# Altium schematic sheet Overview.SchDoc
size A4; SheetNumber: 1; SheetTotal: 7
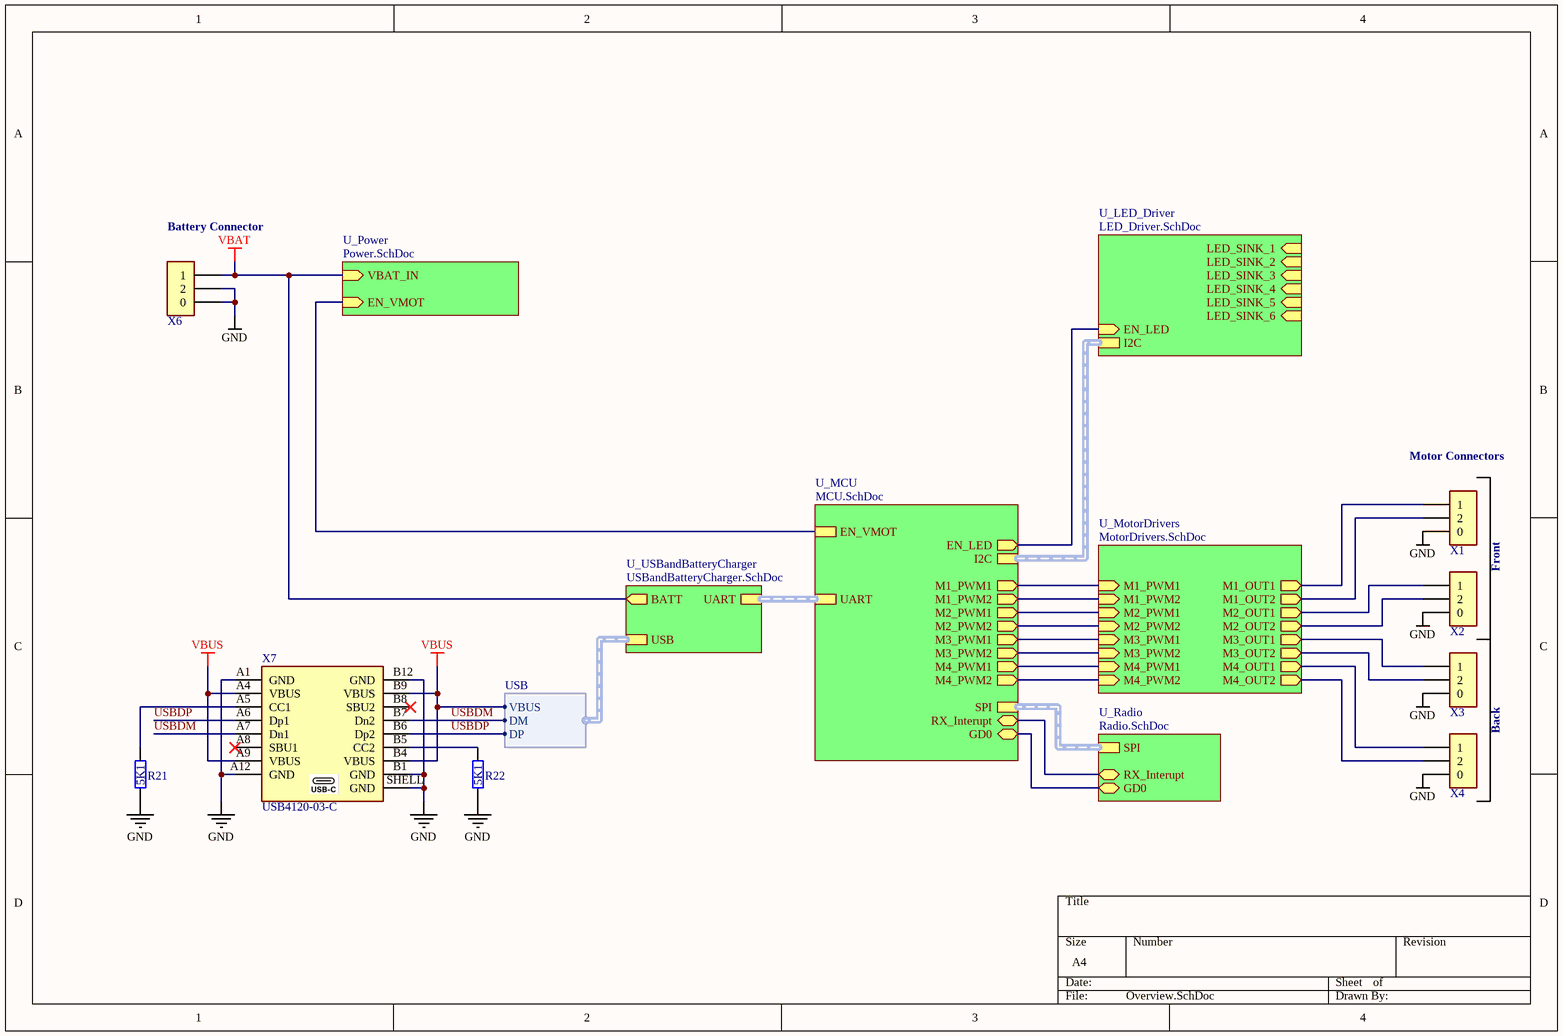
[diagram p0: Overview.SchDoc]

## Parts
R21  5K1  [0603]  (value not drawn)
R22  5K1  [0603]  (value not drawn)
X1  BM02B-SRSS-TB  [BM02B-SRSS-TB]  (value not drawn)
X2  BM02B-SRSS-TB  [BM02B-SRSS-TB]  (value not drawn)
X3  BM02B-SRSS-TB  [BM02B-SRSS-TB]  (value not drawn)
X4  BM02B-SRSS-TB  [BM02B-SRSS-TB]  (value not drawn)
X6  BM02B-SRSS-TB  [BM02B-SRSS-TB]  (value not drawn)
X7  USB4120-03-C  [USB4120]

## Sub-sheets
U_LED_Driver = LED_Driver.SchDoc: LED_SINK_1 (in), LED_SINK_2 (in), LED_SINK_3 (in), LED_SINK_4 (in), LED_SINK_5 (in), LED_SINK_6 (in), EN_LED (in), I2C (harness I2C)
U_MCU = MCU.SchDoc: SPI (harness SPI), UART (harness UART), M1_PWM1 (out), M1_PWM2 (out), M2_PWM1 (out), M2_PWM2 (out), M3_PWM1 (out), M3_PWM2 (out), M4_PWM1 (out), M4_PWM2 (out), EN_VMOT, RX_Interupt (bidir), GD0 (bidir), I2C, EN_LED (out)
U_MotorDrivers = MotorDrivers.SchDoc: M1_PWM1 (in), M1_PWM2 (in), M2_PWM1 (in), M2_PWM2 (in), M3_PWM1 (in), M3_PWM2 (in), M4_PWM1 (in), M4_PWM2 (in), M1_OUT1 (out), M1_OUT2 (out), M2_OUT1 (out), M2_OUT2 (out), M3_OUT1 (out), M3_OUT2 (out), M4_OUT1 (out), M4_OUT2 (out)
U_Power = Power.SchDoc: VBAT_IN (in), EN_VMOT (in)
U_Radio = Radio.SchDoc: SPI (harness SPI), RX_Interupt (bidir), GD0 (bidir)
U_USBandBatteryCharger = USBandBatteryCharger.SchDoc: UART (harness UART), USB (harness USB), BATT (out)

## Harnesses
USB: VBUS, DP, DM

## Nets
GND: R21.1 R22.1 X1.0 X2.0 X3.0 X4.0 X6.0 X6.2 X7.A1(GND) X7.A12(GND) X7.B1(GND) X7.B12(GND) X7.SHELL(GND)
VBAT: X6.1 ; sheet U_Power/VBAT_IN, sheet U_USBandBatteryCharger/BATT
VBUS: X7.A4(VBUS) X7.A9(VBUS) X7.B4(VBUS) X7.B9(VBUS) ; sheet U_USBandBatteryCharger/USB.VBUS
USBDM: X7.A7(Dn1) X7.B7(Dn2) ; sheet U_USBandBatteryCharger/USB.DM
USBDP: X7.A6(Dp1) X7.B6(Dp2) ; sheet U_USBandBatteryCharger/USB.DP
NetR21_2: R21.2 X7.A5(CC1)
NetR22_2: R22.2 X7.B5(CC2)
NetX1_1: X1.1 ; sheet U_MotorDrivers/M1_OUT1
NetX1_2: X1.2 ; sheet U_MotorDrivers/M1_OUT2
NetX2_1: X2.1 ; sheet U_MotorDrivers/M2_OUT1
NetX2_2: X2.2 ; sheet U_MotorDrivers/M2_OUT2
NetX3_1: X3.1 ; sheet U_MotorDrivers/M3_OUT1
NetX3_2: X3.2 ; sheet U_MotorDrivers/M3_OUT2
NetX4_1: X4.1 ; sheet U_MotorDrivers/M4_OUT1
NetX4_2: X4.2 ; sheet U_MotorDrivers/M4_OUT2
(unnamed): sheet U_Radio/RX_Interupt, sheet U_MCU/RX_Interupt
(unnamed): sheet U_Radio/GD0, sheet U_MCU/GD0
(unnamed): sheet U_MCU/M1_PWM1, sheet U_MotorDrivers/M1_PWM1
(unnamed): sheet U_MCU/M1_PWM2, sheet U_MotorDrivers/M1_PWM2
(unnamed): sheet U_MCU/M2_PWM1, sheet U_MotorDrivers/M2_PWM1
(unnamed): sheet U_MCU/M2_PWM2, sheet U_MotorDrivers/M2_PWM2
(unnamed): sheet U_MCU/M3_PWM1, sheet U_MotorDrivers/M3_PWM1
(unnamed): sheet U_MCU/M3_PWM2, sheet U_MotorDrivers/M3_PWM2
(unnamed): sheet U_MCU/M4_PWM1, sheet U_MotorDrivers/M4_PWM1
(unnamed): sheet U_MCU/M4_PWM2, sheet U_MotorDrivers/M4_PWM2
(unnamed): sheet U_MCU/EN_VMOT, sheet U_Power/EN_VMOT
(unnamed): sheet U_MCU/EN_LED, sheet U_LED_Driver/EN_LED

Not connected (* = marked no-connect by the designer): X7 A8(SBU1)* B8(SBU2)*

## Buses and harness runs
harness sheet U_LED_Driver/I2C = sheet U_MCU/I2C
harness sheet U_MCU/SPI = sheet U_Radio/SPI
harness sheet U_MCU/UART = sheet U_USBandBatteryCharger/UART

## Notes on the sheet
- (near X6) Battery Connector
- (near X1) Motor Connectors
- Front
- Back

## Library data of the parts
R21 R22 = 000053: Part Number: 000053; Manufacturer: YAGEO; Manufacturer Partnummber: RC0603FR-075K1L; =Value: 10K; Component Type: Standard; ComponentLink1Description: Datasheet; ComponentLink2Description: Manufacturer Site; Value: 5K1; JLCPCB Part #: C23196
X1-X4 X6 = BM02B-SRSS-TB: Manufacturer: JST; Manufacturer Partnummber: BM02B-SRSS-TB
X7 = USB4120-03-C: Manufacturer: GCT; Manufacturer Partnummber: USB4120-03-C